# EAGLE design Driver_parra (EAGLE 6.4)
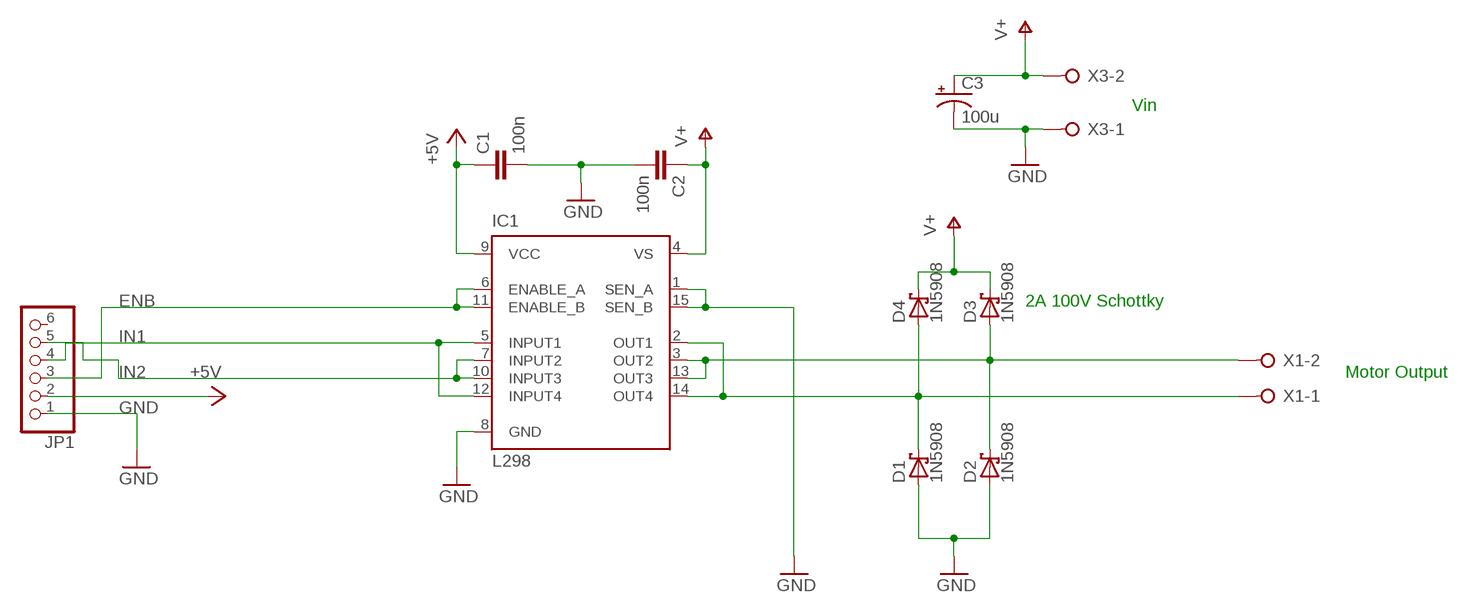
[diagram p0: schematic, sheet 1]

## Parts
C1  100n  C-EUC0805K  [C0805K]
C2  100n  C-EUC0805K  [C0805K]
C3  100u  CPOL-USE7.5-16  [E7,5-16]
D1  1N5908  [C4111-15]
D2  1N5908  [C4111-15]
D3  1N5908  [C4111-15]
D4  1N5908  [C4111-15]
IC1  L298  [MULTIWATT-15]
JP1  PINHD-1X6  [1X06]
X1  W237-02P  [W237-132]
X3  W237-02P  [W237-132]

## Nets
+5V: C1.1 IC1.9(VCC) JP1.2
ENB: IC1.6(ENABLE_A) IC1.11(ENABLE_B) JP1.3
GND: C1.2 C2.2 C3.- D1.A D2.A IC1.1(SEN_A) IC1.8(GND) IC1.15(SEN_B) JP1.1 X3.1
IN1: IC1.5(INPUT1) IC1.12(INPUT4) JP1.4
IN2: IC1.7(INPUT2) IC1.10(INPUT3) JP1.5
OUT1: D1.C D4.A IC1.2(OUT1) IC1.14(OUT4) X1.1
OUT2: D2.C D3.A IC1.3(OUT2) IC1.13(OUT3) X1.2
V+: C2.1 C3.+ D3.C D4.C IC1.4(VS) X3.2
Unconnected: JP1.6

## Notes on the sheet
- Vin
- 2A 100V Schottky
- Motor Output

## Library data of the parts
C1 C2 = resistor:C-EU: CAPACITOR, European symbol
C3 = resistor:CPOL-US: POLARIZED CAPACITOR, American symbol
D1-D4 = diode:1N5908: DIODE schottky
IC1 = st-microelectronics:L298: DUAL FULL-BRIDGE DRIVER; MPN: L298N; OC_FARNELL: 1589425; OC_NEWARK: 32M1527
JP1 = pinhead:PINHD-1X6: PIN HEADER
X1 X3 = con-wago-508:W237-02P: WAGO SREW CLAMP; OC_FARNELL: unknown; OC_NEWARK: unknown

## Board
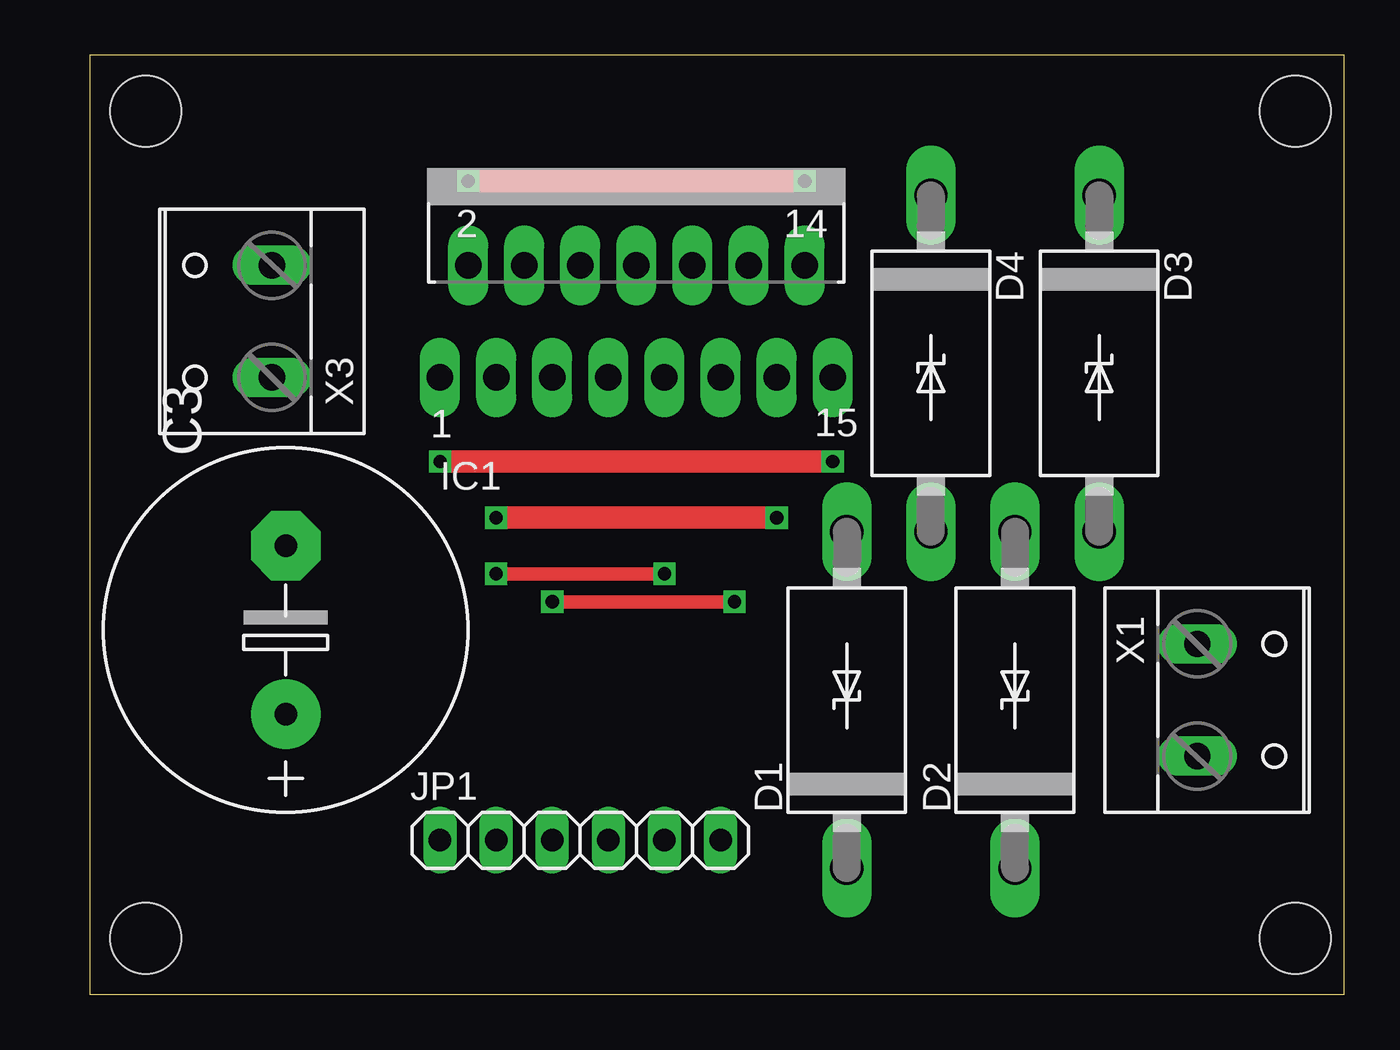
[diagram p1: board, top side]
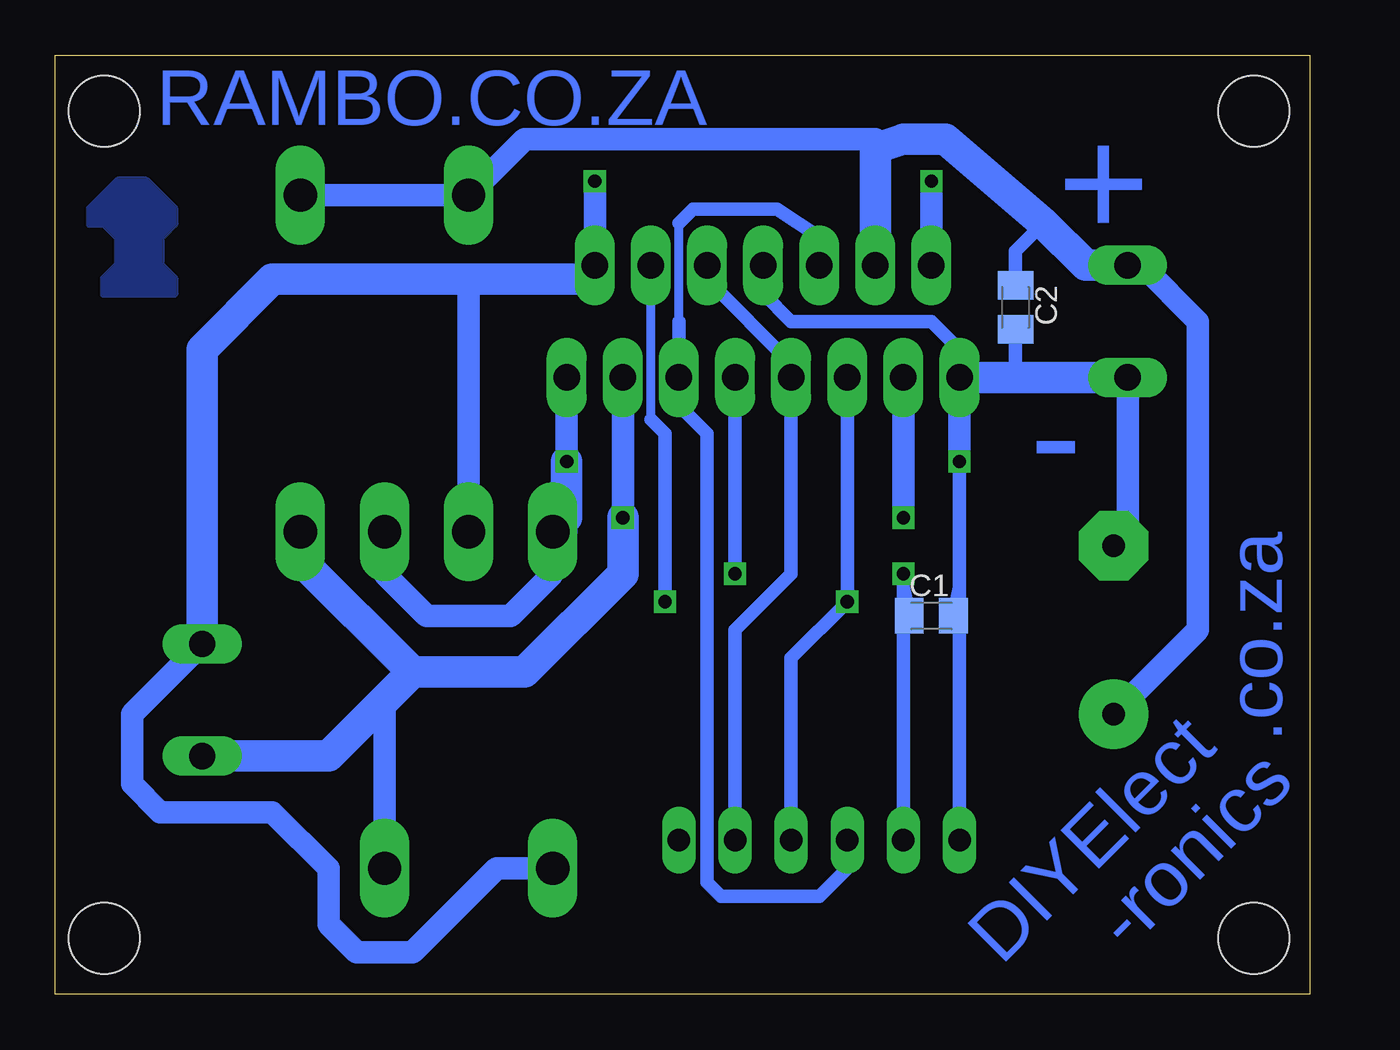
[diagram p2: board, bottom side, seen from below]

Size 56.82 x 42.53 mm. Coordinates in mm from the lower left corner, seen from the top.
Outline: 0,0 56.82,0 56.82,42.53 0,42.53 0,0
Copper layers (1*16): Top 0.035mm / dielectric 1.5mm / Bottom 0.035mm
Design rules "default": minimum track width 10mil, minimum drill 24mil, track to track 8mil, track to pad 8mil, pad to pad 8mil, via to via 8mil, smd to smd 8mil, copper to edge 40mil, drill to drill 8mil, minimum pad ring 10mil, minimum via ring 8mil, stop-mask expansion 4mil, vias tented up to drill 0mil, thermal gap 10mil
Holes 3.2 mm at 2.54,40.01 54.61,40.01 54.61,2.54 2.54,2.54
bKeepout: 7 lines

### Footprints (pad centres in the part's own frame; a part is rotated, then mirrored left to right if it is on the bottom)
C0805K = smd 1.3 x 1.6: 1 -1,0; 2 1,0
E7,5-16 = drill 1.016 pad 3.15: + -3.81,0 | drill 1.016 pad 3.15 octagon: - 3.81,0
C4111-15 = drill 1.499 long: A 7.62,0; C -7.62,0
MULTIWATT-15 = drill 1.2 long: 1 -8.89,-7.62; 2 -7.62,-2.54; 3 -6.35,-7.62; 4 -5.08,-2.54; 5 -3.81,-7.62; 6 -2.54,-2.54; 7 -1.27,-7.62; 8 0,-2.54; 9 1.27,-7.62; 10 2.54,-2.54; 11 3.81,-7.62; 12 5.08,-2.54; 13 6.35,-7.62; 14 7.62,-2.54; 15 8.89,-7.62
1X06 = drill 1.016 long: 1 -6.35,0; 2 -3.81,0; 3 -1.27,0; 4 1.27,0; 5 3.81,0; 6 6.35,0
W237-132 = drill 1.194 long: 1 -2.54,-0.635; 2 2.54,-0.635

### Placement (x,y rotation side)
C1  17.14,17.14 0 bottom
C2  13.34,31.11 270 bottom
C3  8.89,16.51 90 top
D1  34.29,13.34 90 top
D2  41.91,13.34 90 top
D3  45.72,28.57 270 top
D4  38.1,28.57 270 top
IC1  24.77,35.56 0 top
JP1  22.23,6.99 0 top
X1  50.8,13.34 270 top
X3  7.62,30.48 90 top

### Tracks (layer width: path | path; a pad name or v marks a point on that pad's centre or on a via)
+5V  (via drill 0.6)
  Top 0.61: v26.04,19.05 v18.41,19.05
  Bottom 0.61: IC1.9 v26.04,19.05 | v18.41,19.05 18.41,18.41 | 18.41,18.41 JP1.2 | C1.1 18.41,18.41
ENB
  Bottom 0.406: 28.57,30.48 28.57,34.92
  Bottom 0.61: 28.57,30.48 IC1.11 28.57,26.67 27.3,25.4 27.3,5.08 26.67,4.45 22.23,4.45 20.95,5.71 JP1.3 | 28.57,34.92 27.94,35.56 24.13,35.56 22.23,34.29 IC1.6
GND  (via drill 0.6)
  Top 1.016: v15.88,24.13 v33.66,24.13
  Bottom 0.61: IC1.8 24.77,31.75 23.5,30.48 17.14,30.48 15.88,29.21 IC1.1 | JP1.1 15.88,18.41 | 15.88,18.41 v15.88,24.13 | C2.2 13.34,27.94 | C1.2 15.88,18.41
  Bottom 1.016: IC1.1 v15.88,24.13 | v33.66,24.13 IC1.15 | D2.A 41.91,19.05 40.01,17.14 36.2,17.14 34.29,19.05 D1.A 33.66,20.95 | X3.1 8.26,20.95 C3.-
  Bottom 1.422: X3.1 13.34,27.94 IC1.1 | v33.66,24.13 33.66,21.59 D1.A
IN1  (via drill 0.6)
  Top 0.61: v20.95,17.78 v29.21,17.78
  Bottom 0.406: 29.84,26.04 IC1.12
  Bottom 0.61: IC1.5 v20.95,17.78 23.5,15.24 JP1.4 | 29.84,26.04 29.21,25.4 v29.21,17.78
IN2
  Bottom 0.61: IC1.10 27.3,32.38 23.5,28.57 IC1.7 23.5,19.05 26.04,16.51 JP1.5
N$1
  pour Bottom: 51.44,34.92 51.44,35.56 52.7,36.83 53.98,36.83 55.24,35.56 55.24,34.92 54.61,34.92 53.98,34.29 53.98,33.02 54.61,32.38 54.61,31.75 51.44,31.75 51.44,32.38 52.07,33.02 52.07,34.29
OUT1  (via drill 0.6)
  Top 1.016: v17.14,36.83 v32.38,36.83
  Bottom 1.016: IC1.2 v17.14,36.83 | v32.38,36.83 IC1.14 | D1.C 36.83,5.71 40.64,1.91 43.18,1.91 44.45,3.17 44.45,5.71 46.99,8.26 52.07,8.26 53.34,9.53 53.34,12.7 X1.1 | D4.A 38.1,32.38
  Bottom 1.422: X1.1 50.16,29.21 46.99,32.38 38.1,32.38 33.02,32.38 IC1.14
OUT2  (via drill 0.6)
  Top 1.016: v18.41,21.59 v31.11,21.59
  Bottom 1.016: IC1.3 v18.41,21.59 | v31.11,21.59 IC1.13 | D2.C 41.91,13.34 40.64,14.61
  Bottom 1.422: D3.A 45.72,19.68 40.64,14.61 | 40.64,14.61 35.56,14.61 31.11,19.05 v31.11,21.59 | X1.2 44.45,10.79 40.64,14.61
V+
  Bottom 0.61: 8.38,33.02 X3.2 | C2.1 13.34,33.66 12.06,34.92
  Bottom 1.016: D3.C D4.C 35.56,38.73 19.68,38.73 19.37,38.42 | X3.2 7.62,33.02 5.08,30.48 5.08,16.51 C3.+
  Bottom 1.422: IC1.4 19.68,38.1 19.37,38.42 18.41,38.73 16.51,38.73 12.06,34.92 10.16,33.02 8.38,33.02

### Text on the board
Bottom: RAMBO.CO.ZA | + | - | .co.za | -ronics | DIYElect